# EAGLE design Astron_AltOsc (EAGLE 9.6.2)
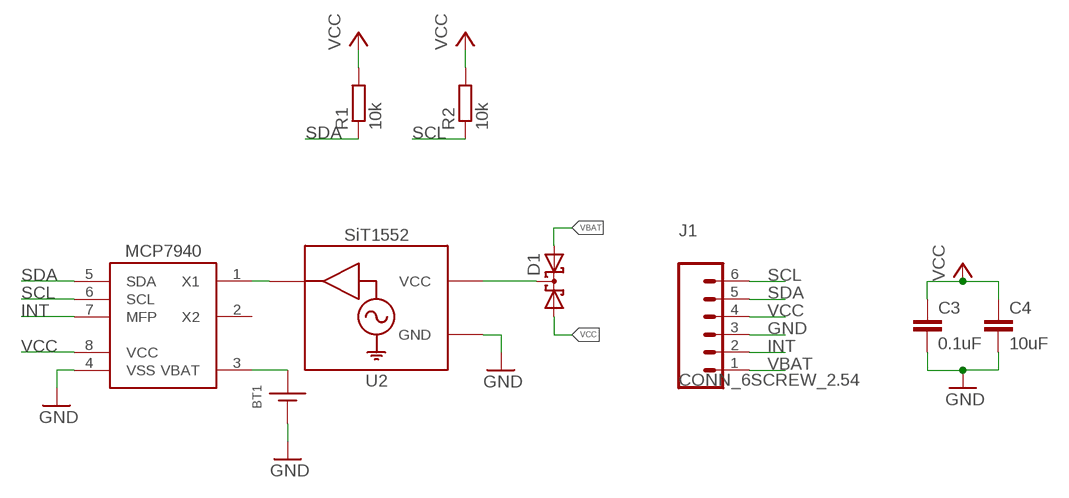
[diagram p0: schematic, sheet 1]

## Parts
BT1  BATTERY_COIN12MM  [LINX_BAT-HLD-012-SMT]
C3  0.1uF  C-EU0.1UFC0603  [C0603]
C4  10uF  C-EU10UFC0805  [C0805]
D1  DIODE_CCBAT54CSOT23  [SOT23-3]
J1  CONN_6SCREW_2.54  [1X06_SCREW]
R1  10k  R-EU_R0603  [R0603]
R2  10k  R-EU_R0603  [R0603]
U1  MCP7940SOIC  [SO08]
U2  SIT1552  [LD-4]

## Nets
GND: BT1.GND(-) C3.2 C4.2 J1.3 U1.4(VSS) U2.1(GND) U2.4(GND)
INT: J1.2 U1.7(MFP)
N$1: U1.1(X1) U2.2(CLK)
N$2: D1.3(C) U2.3(VCC)
SCL: J1.6 R2.1 U1.6(SCL)
SDA: J1.5 R1.1 U1.5(SDA)
VBAT: BT1.POWER0(+) BT1.POWER1(+) D1.2(A2) J1.1 U1.3(VBAT)
VCC: C3.1 C4.1 D1.1(A1) J1.4 R1.2 R2.2 U1.8(VCC)
Unconnected: U1.2(X2)

## Library data of the parts
BT1 = bschulz:BATTERY_COIN: Coin Cell Battery Holder; DIGIKEY: BAT-HLD-012-SMT-ND; MF: Linx; MPN: BAT-HLD-012-SMT
C3 = bschulz_passives:C-EU: CAPACITOR, European symbol; DIGIKEY: 490-6051-1-ND; MF: Murata; MPN: GCM188R71E104KA57D
C4 = bschulz_passives:C-EU: CAPACITOR, European symbol; DIGIKEY: 490-6473-1-ND; MF: Murata; MPN: GRM21BR61C106KE15K
D1 = bschulz:DIODE_CC: Dual Diode, Common Cathode BAT54C Vr, max: 30V Iavg: 200mA Vf: 800mv @ 100mA Reverse Leakage: 2μA @ 25V SDM40E20LC Vr, max: 20V Iavg: 400mA Vf: 310mv @ 100mA Reverse Leakage: 250μA @ 20V; DIGIKEY: BAT54CLT1GOSCT-ND; MF: ON Semiconductor; MPN: BAT54CLT1G
J1 = bschulz:CONN_6: Genaric 6 terminal header Digikey 2.54_SCREW <https://www.digikey.com/product-detail/en/on-shore-technology-inc/OSTVN06A150/ED10565-ND/1588866>; DIGIKEY: ED10565-ND; MF: OnShore; MPN: OSTVN06A150
R1 R2 = bschulz_passives:R-EU_: RESISTOR, European symbol Digikey Parts: Yageo, 0402 <https://www.digikey.com/products/en/resistors/chip-resistor-surface-mount/52?k=&pkeyword=&sv=0&s=4356&sf=1&FV=-1%7C13%2C7%7C2%2C1291%7C39157%2C1989%7C0%2C-8%7C52%2C3%7C1131%2C3%7C2503&quantity=&ColumnSort=0&page=1&stock=1&pageSize=25> Yageo, 0603 <https://www.digikey.com/products/en/resistors/chip-resistor-surface-mount/52?k=&pkeyword=&sv=0&pv1291=39245&sf=1&FV=-5%7C4356%2C-5%7C47360%2C-8%7C52%2C-1%7C13%2C7%7C2%2C1989%7C0&quantity=10&ColumnSort=1000011&page=1&stock=1&pageSize=25> Panasonic, 0603 <https://www.digikey.com/products/en/resistors/chip-resistor-surface-mount/52?k=&pkeyword=&pv252=68&sf=0&FV=ffec373d%2C1c0002%2C142c040c%2C1f140000%2Cffe00034%2C80002%2Cc0001&quantity=&ColumnSort=0&page=1&stock=1&pageSize=25> Panasonic, precision, 0603 <https://www.digikey.com/products/en/resistors/chip-resistor-surface-mount/52?FV=ffec4907%2Cfffc000a%2Cc0172%2C142c040c%2C1f140000%2Cffe00034%2C1c0002&quantity=100&ColumnSort=2085&page=1&stock=1&pageSize=25> Panasonic, 0805 <https://www.digikey.com/products/en/resistors/chip-resistor-surface-mount/52?k=&pkeyword=&pv3=1&sf=0&FV=ffec373d%2C1c0002%2C1f140000%2Cffe00034%2C142c040d&quantity=&ColumnSort=0&page=1&stock=1&pageSize=25> Rohm, current sense <https://www.digikey.com/products/en/resistors/chip-resistor-surface-mount/52?k=&pkeyword=&pv3=1&sf=0&FV=ffecb688%2C1f140000%2Cffe00034%2C1c0002&quantity=&ColumnSort=0&page=1&stock=1&pageSize=25> Vishay, pulse proof automotive <https://www.digikey.com/products/en/resistors/chip-resistor-surface-mount/52?k=&pkeyword=&pv7=2&sf=0&FV=ffec5d6b%2Cffe00034%2C1f140000&quantity=&ColumnSort=0&page=1&stock=1&pageSize=25>; MF: Yageo
U1 = bschulz:MCP7940: MCP7940 - RTC Characteristics: VCC: 1.8~5.5V VBat: 1.3~5.5V Memory: 64B Interface: I2C Operating Temperature: -40°C to 85°C Digikey: MCP7940N-I/SN-ND <https://www.digikey.com/scripts/DkSearch/dksus.dll?Detail&itemSeq=257151033&uq=636590618847128166> Pin Compatible Alternatives <https://www.digikey.com/products/en/integrated-circuits-ics/clock-timing-real-time-clocks/690?FV=401994%2C26802e4%2C45003ef%2C450041e%2C4500072%2C450050c%2C4500565%2C450057c%2C450057e%2C4500010%2C4500011%2C4500017%2C450017d%2C4500180%2C450004f%2C1f140000%2Cffe002b2%2C16980015%2C1698001a%2C1698001d%2C16980026%2C16980027%2C16980029%2C16980036%2C16980009&quantity=10&ColumnSort=1000011&page=2&stock=1&nstock=1&pageSize=25> Note: These are recomendations at the time, always verify pin compatability using combination of Mrk1 EyeBall and quality datasheet; DIGIKEY: MCP7940N-I/SN-ND; MF: Microchip; MPN: MCP7940N-I/SN
U2 = bschulz:SIT1552: SiT1552 - Ultra Low Power 32.768 kHz MEMS TCXO Characteristics: Vin: 1.5~3.63V IQ: <1μA Frequency Stability: ±5, ±10, ±20 ppm Operating Temperature: -40°C to 125°C Digikey: 1473-1242-1-ND (±10ppm) <https://www.digikey.com/en/products/detail/sitime/SIT1552AI-JF-DCC-32-768D/5035515>; DIGIKEY: 1473-1242-1-ND; DISP: SiT1552; MF: SiTime; MPN: SIT1552AI-JF-DCC-32.768D

## Board
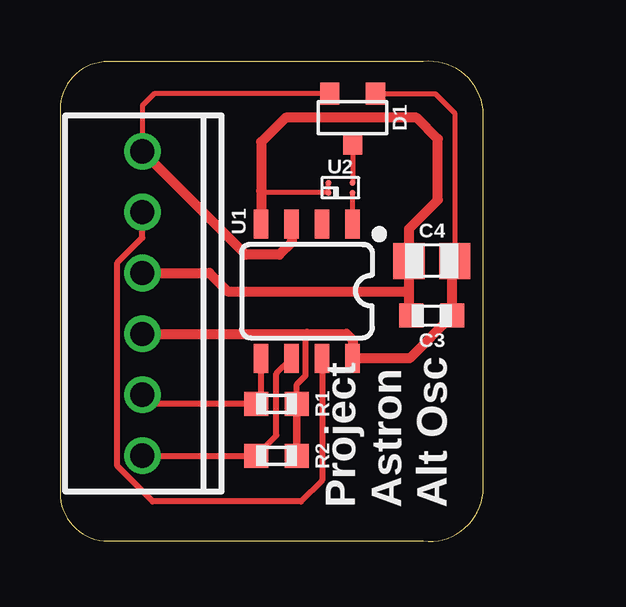
[diagram p1: board, top side]
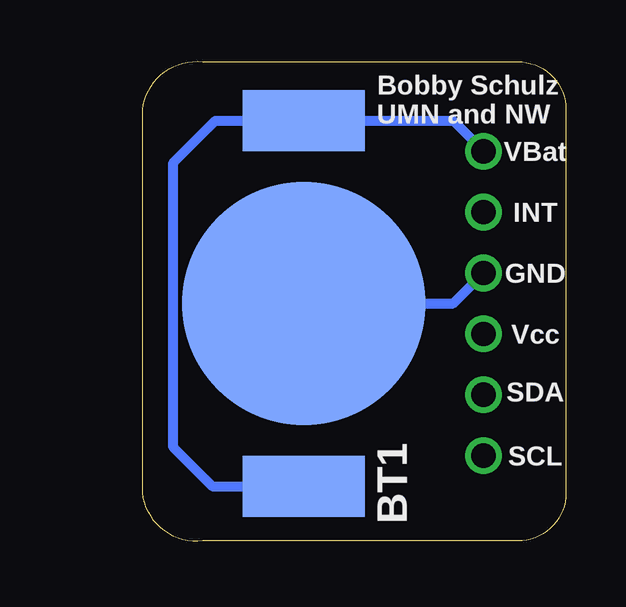
[diagram p2: board, bottom side, seen from below]

Size 17.63 x 20.02 mm. Coordinates in mm from the lower left corner, seen from the top.
Outline: 0,18 0,2.01 arc90 2,0.01 15.12,0.01 arc90 17.63,2.01 17.63,18 arc90 15.12,20 2,20 arc90 0,18
Copper layers (1*16): Top 0.035559375mm / dielectric 1.6mm / Bottom 0.035559375mm
Design rules "oshpark-2layer": minimum track width 6mil, minimum drill 10mil, track to track 6mil, track to pad 6mil, pad to pad 6mil, via to via 6mil, smd to smd 6mil, copper to edge 15mil, drill to drill 6mil, minimum pad ring 5mil, minimum via ring 5mil, stop-mask expansion 2.5mil, vias tented up to drill 0mil, thermal gap 10mil

### Footprints (pad centres in the part's own frame; a part is rotated, then mirrored left to right if it is on the bottom)
LINX_BAT-HLD-012-SMT = smd 10.16 x 10.16: GND 0,0 | smd 2.54 x 5.08: POWER0 -7.62,0; POWER1 7.62,0
C0603 = smd 1 x 1: 1 -0.85,0; 2 0.85,0
C0805 = smd 1.3 x 1.5: 1 -0.95,0; 2 0.95,0
SOT23-3 = smd 0.8 x 0.9: 1 -0.95,-1; 2 0.95,-1; 3 0,1.1
1X06_SCREW = drill 1.016: 1 -6.35,0; 2 -3.81,0; 3 -1.27,0; 4 1.27,0; 5 3.81,0; 6 6.35,0
R0603 = smd 1 x 1: 1 -0.85,0; 2 0.85,0
SO08 = smd 0.6 x 1.2: 1 -1.905,-2.8; 2 -0.635,-2.8; 3 0.635,-2.8; 4 1.905,-2.8; 5 1.905,2.8; 6 0.635,2.8; 7 -0.635,2.8; 8 -1.905,2.8
LD-4 = smd 0.25 x 0.25: 1 -0.5,-0.205; 2 0.5,-0.205; 3 0.5,0.205; 4 -0.5,0.205

### Placement (x,y rotation side)
BT1  10.92,9.92 270 bottom
C3  15.49,9.41 180 top
C4  15.49,11.7 180 top
D1  12.19,17.67 180 top
J1  3.43,9.92 270 top
R1  9.02,5.73 0 top
R2  9.02,3.57 0 top
U1  10.29,10.43 180 top
U2  11.68,14.75 0 top

### Tracks (layer width: path | path; a pad name or v marks a point on that pad's centre or on a via)
GND
  Top 0.2: U2.4 U2.1 8.46,14.54 8.38,14.62
  Top 0.406: C3.2 14.54,9.51 14.54,10.43 | 14.54,10.43 C4.2 14.54,13.03 15.75,14.24 15.75,16.78 14.86,17.67 9.4,17.67 8.38,16.65 8.38,14.62 U1.4 | J1.3 6.22,11.19 6.99,10.43 14.54,10.43
  Bottom 0.406: BT1.GND 4.7,9.92 J1.3
INT
  Top 0.254: U1.7 10.92,2.55 10.03,1.66 3.86,1.66 2.39,3.14 2.39,11.62 3.43,12.66 J1.2
N$1
  Top 0.2: U2.2 12.18,13.24 U1.1
N$2
  Top 0.2: D1.3 12.19,14.96 U2.3
SCL
  Top 0.254: J1.6 R2.1 9.02,4.42 9.02,6.99 U1.6
SDA
  Top 0.254: U1.5 8.38,5.94 R1.1 3.81,5.73 J1.5
VBAT
  Top 0.2: D1.2 3.92,18.67 3.43,18.17 J1.1
  Top 0.406: U1.3 9.65,12.46 9.14,11.95 7.75,11.95 J1.1
  Bottom 0.406: BT1.POWER1 14.73,2.3 16.36,3.93 16.36,15.79 14.61,17.54 BT1.POWER0 4.7,17.54 J1.1
VCC
  Top 0.2: D1.1 15.64,18.67 16.44,17.86 C4.1
  Top 0.254: R1.2 9.87,6.55 10.23,6.91 10.23,8.59 10.29,8.65
  Top 0.305: R1.2 R2.2
  Top 0.406: C4.1 16.34,11.6 C3.1 14.57,7.63 U1.8 | U1.8 | J1.4 10.29,8.65 11.94,8.65 12.2,8.39 U1.8

### Text on the board
tPlace: Project / Astron / Alt Osc
bPlace: Bobby Schulz / UMN and NW | VBat | INT | GND | Vcc | SDA | SCL